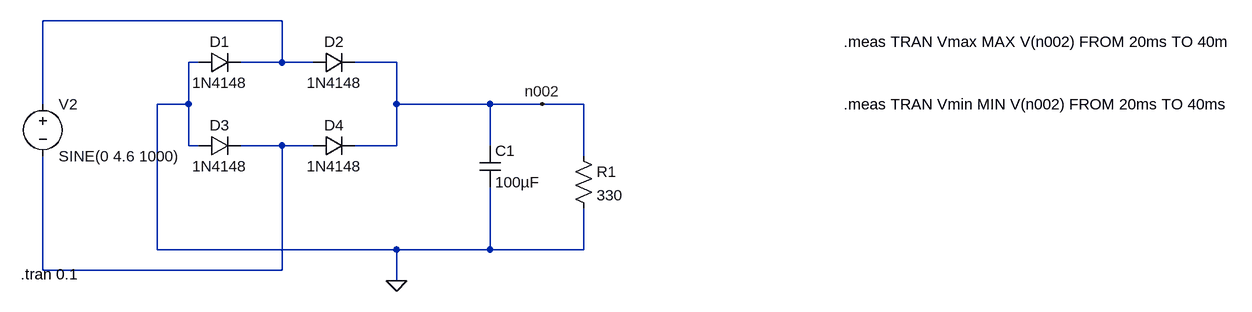
[diagram p0: schematic Draft2.asc]
Draft2.asc, the LTspice schematic file:
Version 4
SHEET 1 1304 680
WIRE -192 -192 -560 -192
WIRE -320 -128 -336 -128
WIRE -192 -128 -192 -192
WIRE -192 -128 -256 -128
WIRE -144 -128 -192 -128
WIRE -16 -128 -80 -128
WIRE -560 -64 -560 -192
WIRE -336 -64 -336 -128
WIRE -336 -64 -384 -64
WIRE -16 -64 -16 -128
WIRE 128 -64 -16 -64
WIRE 208 -64 128 -64
WIRE 272 -64 208 -64
WIRE -336 0 -336 -64
WIRE -320 0 -336 0
WIRE -192 0 -256 0
WIRE -144 0 -192 0
WIRE -16 0 -16 -64
WIRE -16 0 -80 0
WIRE 128 0 128 -64
WIRE 272 16 272 -64
WIRE -384 160 -384 -64
WIRE -16 160 -384 160
WIRE 128 160 128 64
WIRE 128 160 -16 160
WIRE 272 160 272 96
WIRE 272 160 128 160
WIRE -560 192 -560 16
WIRE -192 192 -192 0
WIRE -192 192 -560 192
WIRE -16 208 -16 160
FLAG -16 208 0
FLAG 208 -64 n002
SYMBOL diode -144 -112 R270
WINDOW 0 32 32 VTop 2
WINDOW 3 0 32 VBottom 2
SYMATTR InstName D2
SYMATTR Value 1N4148
SYMBOL diode -320 -112 R270
WINDOW 0 32 32 VTop 2
WINDOW 3 0 32 VBottom 2
SYMATTR InstName D1
SYMATTR Value 1N4148
SYMBOL diode -320 16 R270
WINDOW 0 32 32 VTop 2
WINDOW 3 0 32 VBottom 2
SYMATTR InstName D3
SYMATTR Value 1N4148
SYMBOL diode -144 16 R270
WINDOW 0 32 32 VTop 2
WINDOW 3 0 32 VBottom 2
SYMATTR InstName D4
SYMATTR Value 1N4148
SYMBOL cap 112 0 R0
SYMATTR InstName C1
SYMATTR Value 100µF
SYMBOL res 256 0 R0
SYMATTR InstName R1
SYMATTR Value 330
SYMBOL voltage -560 -80 R0
WINDOW 123 0 0 Left 0
WINDOW 39 0 0 Left 0
SYMATTR InstName V2
SYMATTR Value SINE(0 4.6 1000)
TEXT -594 198 Left 2 !.tran 0.1
TEXT 672 -160 Left 2 !.meas TRAN Vmax MAX V(n002) FROM 20ms TO 40m
TEXT 672 -64 Left 2 !.meas TRAN Vmin MIN V(n002) FROM 20ms TO 40ms

The netlist it stands for:
* Draft2.asc
D2 N001 n002 1N4148
D1 0 N001 1N4148
D3 0 N003 1N4148
D4 N003 n002 1N4148
C1 n002 0 100µF
R1 n002 0 330
V2 N001 N003 SINE(0 4.6 1000)
.model D D
.lib standard.dio
.tran 0.1
.meas TRAN Vmax MAX V(n002) FROM 20ms TO 40m
.meas TRAN Vmin MIN V(n002) FROM 20ms TO 40ms
.backanno
.end